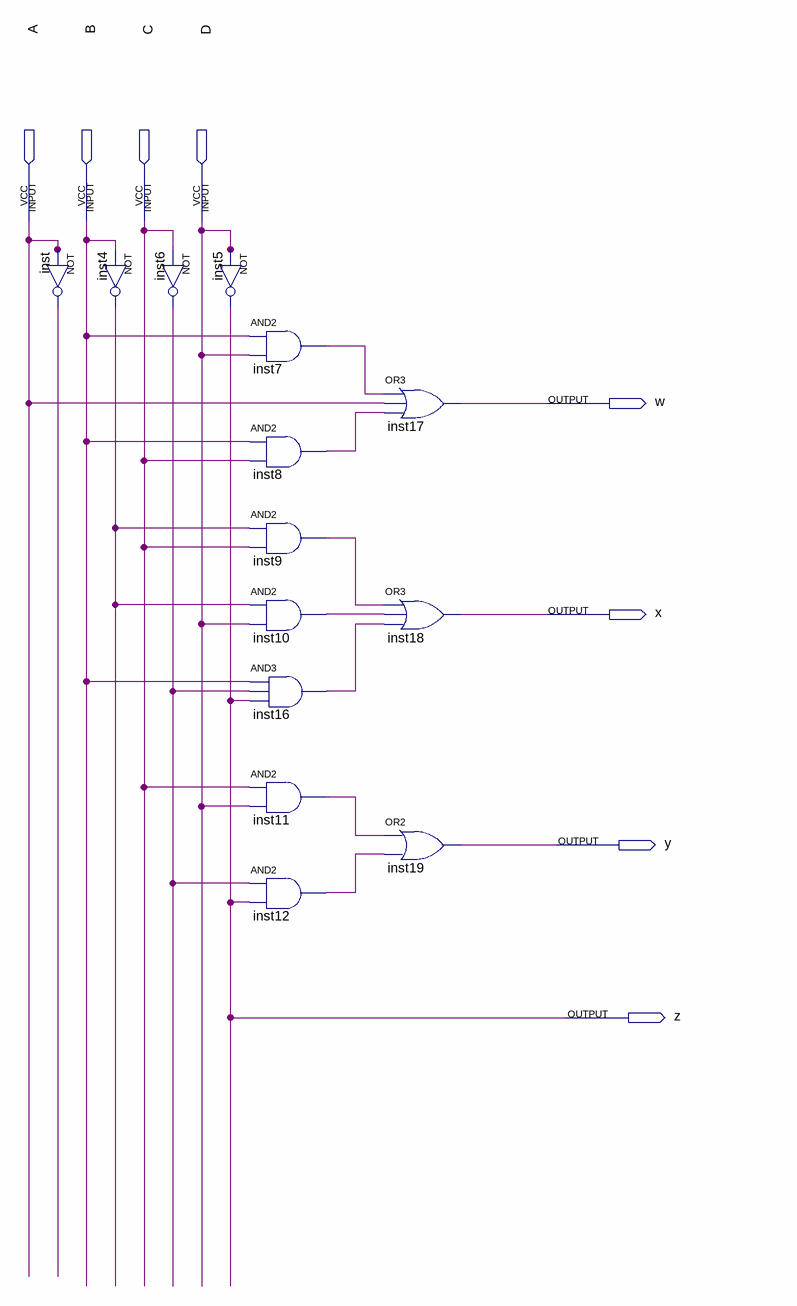
[diagram p0: schematic sheet]
// Quartus schematic Project.bdf as structural Verilog: 14 symbols, 8 pins
module Project (
  input  A,
  input  B,
  input  C,
  input  D,
  output w,
  output x,
  output y,
  output z
);

  wire inst4_out, inst6_out, inst7_out, inst8_out, inst9_out, inst10_out, inst11_out, inst12_out, inst16_out,
       inst_out;

  not inst (inst_out, A);
  not inst4 (inst4_out, B);
  not inst6 (inst6_out, C);
  not inst5 (z, D);
  and inst7 (inst7_out, B, D);
  and inst8 (inst8_out, B, C);
  and inst9 (inst9_out, inst4_out, C);
  and inst10 (inst10_out, inst4_out, D);
  and inst16 (inst16_out, B, inst6_out, z);
  and inst11 (inst11_out, C, D);
  and inst12 (inst12_out, inst6_out, z);
  or inst17 (w, inst7_out, A, inst8_out);
  or inst18 (x, inst9_out, inst10_out, inst16_out);
  or inst19 (y, inst11_out, inst12_out);
endmodule
